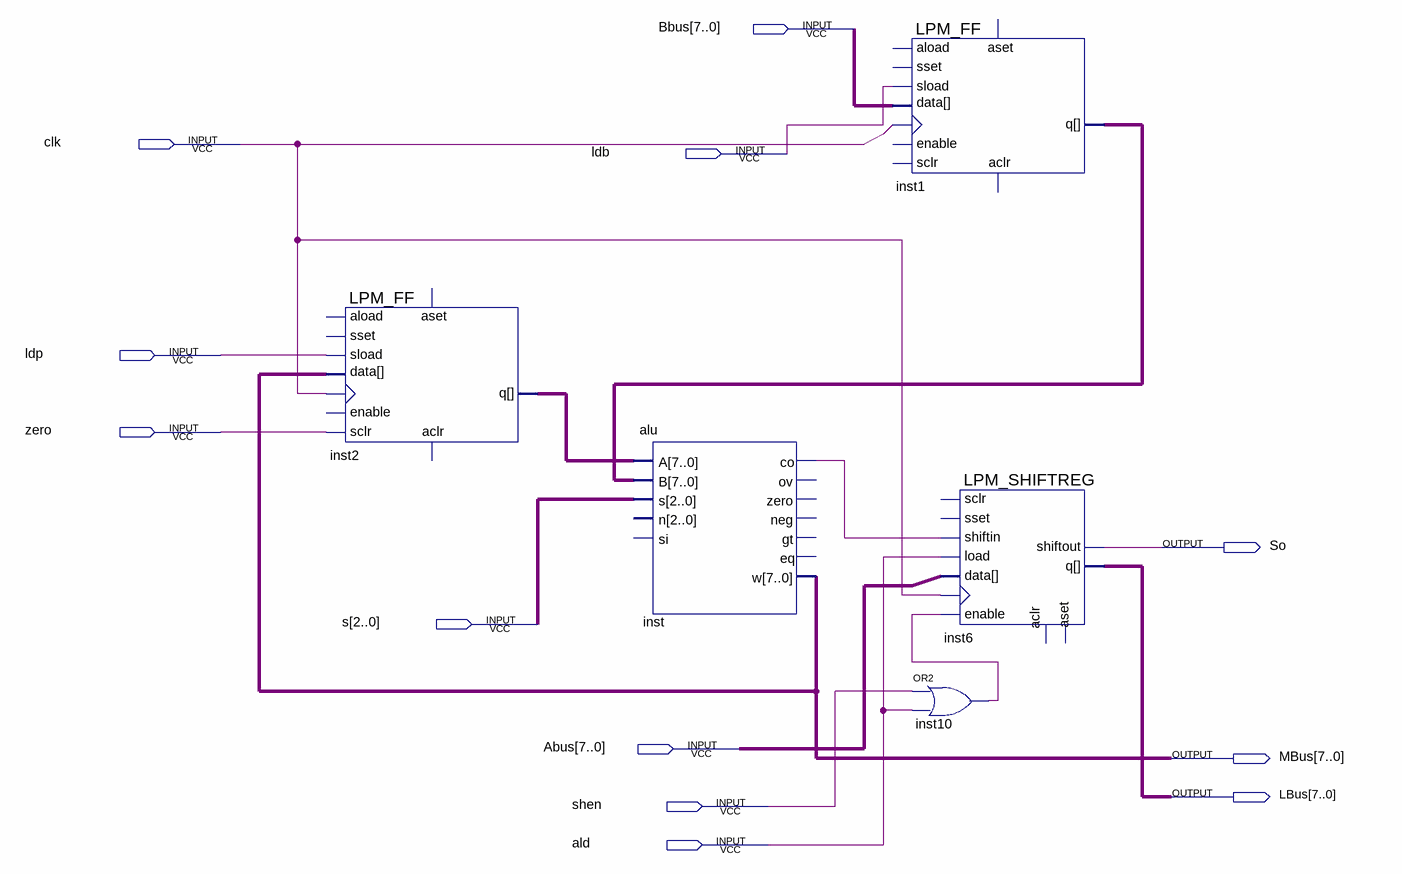
[diagram p0: schematic sheet]
// Quartus schematic Block1.bdf as structural Verilog: 5 symbols, 12 pins
module Block1 (
  input  [7:0] Bbus,
  input  clk,
  input  ldb,
  input  ldp,
  input  zero,
  input  [2:0] s,
  input  [7:0] Abus,
  input  shen,
  input  ald,
  output So,
  output [7:0] MBus,
  output [7:0] LBus
);

  wire inst10_out, inst_co;
  wire [7:0] inst1_q, inst2_q;

  LPM_FF inst2 (
    .clock(clk), .sload(ldp), .sclr(zero), .data(MBus), .q(inst2_q));  // open: enable, aload, sset, aset, aclr
  alu inst (.A(inst2_q), .B(inst1_q), .s(s), .co(inst_co), .w(MBus));  // open: n, si, ov, zero, neg, gt, eq
  LPM_FF inst1 (.clock(clk), .sload(ldb), .data(Bbus), .q(inst1_q));  // open: enable, aload, sset, aset, sclr, aclr
  LPM_SHIFTREG inst6 (
    .shiftin(inst_co), .enable(inst10_out), .clock(clk), .data(Abus), .load(ald), .shiftout(So), .q(LBus));  // open: sset, sclr, aset, aclr
  or inst10 (inst10_out, shen, ald);
endmodule
